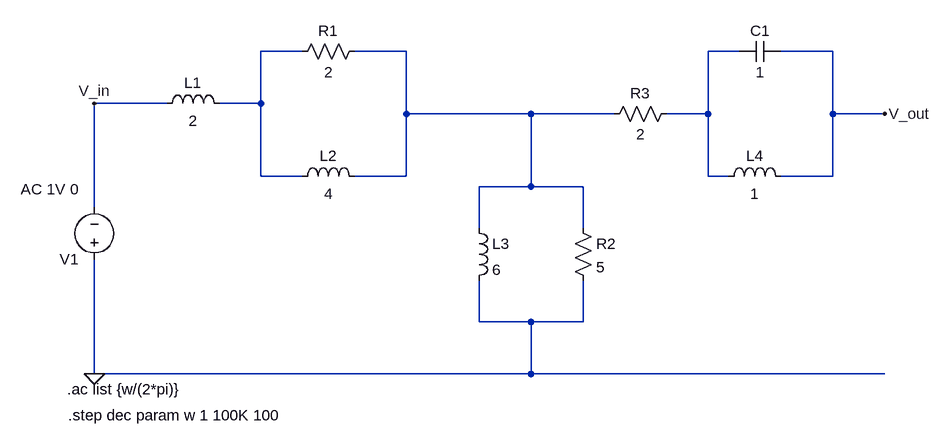
[diagram p0: schematic UE_10.asc]
UE_10.asc, the LTspice schematic file:
Version 4
SHEET 1 1268 680
WIRE 288 16 224 16
WIRE 448 16 368 16
WIRE 960 16 912 16
WIRE 1104 16 1024 16
WIRE 80 96 -32 96
WIRE 224 96 224 16
WIRE 224 96 160 96
WIRE 448 112 448 16
WIRE 640 112 448 112
WIRE 768 112 640 112
WIRE 912 112 912 16
WIRE 912 112 848 112
WIRE 1104 112 1104 16
WIRE 1184 112 1104 112
WIRE 224 208 224 96
WIRE 288 208 224 208
WIRE 448 208 448 112
WIRE 448 208 368 208
WIRE 912 208 912 112
WIRE 944 208 912 208
WIRE 1104 208 1104 112
WIRE 1104 208 1024 208
WIRE 640 224 640 112
WIRE 640 224 560 224
WIRE 720 224 640 224
WIRE -32 256 -32 96
WIRE 560 288 560 224
WIRE 720 288 720 224
WIRE 560 432 560 368
WIRE 640 432 560 432
WIRE 720 432 720 368
WIRE 720 432 640 432
WIRE -32 512 -32 336
WIRE 640 512 640 432
WIRE 640 512 -32 512
WIRE 1184 512 640 512
FLAG -32 512 0
FLAG -32 96 V_in
FLAG 1184 112 V_out
SYMBOL ind 64 112 R270
WINDOW 0 32 56 VTop 2
WINDOW 3 5 56 VBottom 2
SYMATTR InstName L1
SYMATTR Value 2
SYMBOL ind 272 224 R270
WINDOW 0 32 56 VTop 2
WINDOW 3 5 56 VBottom 2
SYMATTR InstName L2
SYMATTR Value 4
SYMBOL ind 544 272 R0
SYMATTR InstName L3
SYMATTR Value 6
SYMBOL ind 928 224 R270
WINDOW 0 32 56 VTop 2
WINDOW 3 5 56 VBottom 2
SYMATTR InstName L4
SYMATTR Value 1
SYMBOL res 272 32 R270
WINDOW 0 32 56 VTop 2
WINDOW 3 0 56 VBottom 2
SYMATTR InstName R1
SYMATTR Value 2
SYMBOL res 704 272 R0
SYMATTR InstName R2
SYMATTR Value 5
SYMBOL res 752 128 R270
WINDOW 0 32 56 VTop 2
WINDOW 3 0 56 VBottom 2
SYMATTR InstName R3
SYMATTR Value 2
SYMBOL cap 960 32 R270
WINDOW 0 32 32 VTop 2
WINDOW 3 0 32 VBottom 2
SYMATTR InstName C1
SYMATTR Value 1
SYMBOL voltage -32 352 R180
WINDOW 123 24 124 Left 2
WINDOW 39 0 0 Left 0
SYMATTR InstName V1
SYMATTR Value ""
SYMATTR Value2 AC 1V 0
TEXT -74 536 Left 2 !.ac list {w/(2*pi)}
TEXT -72 576 Left 2 !.step dec param w 1 100K 100

The netlist it stands for:
* UE_10.asc
L1 V_in N001 2
L2 N001 N002 4
L3 N002 0 6
L4 N003 V_out 1
R1 N001 N002 2
R2 N002 0 5
R3 N002 N003 2
C1 N003 V_out 1
V1 0 V_in AC 1V 0
.ac list {w/(2*pi)}
.step dec param w 1 100K 100
.backanno
.end